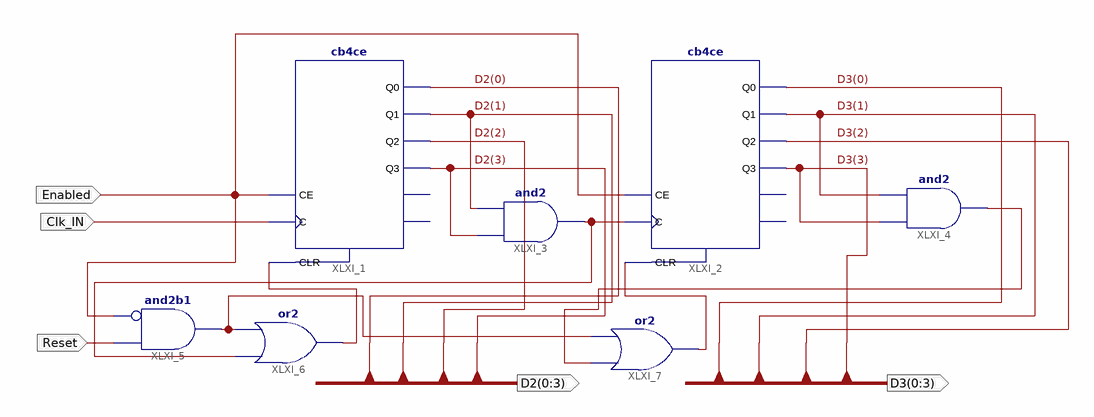
[diagram p0: schematic sheet 1]
// Xilinx ISE schematic Min.sch (spartan6) as structural Verilog: 7 symbols, 5 ports
module Min (
  input  Enabled,
  input  Clk_IN,
  input  Reset,
  output [0:3] D2,
  output [0:3] D3
);

  wire XLXN_38, XLXN_39, XLXN_40, XLXN_41, XLXN_42;

  cb4ce XLXI_1 (
    .C(Clk_IN), .CE(Enabled), .CLR(XLXN_40), .Q0(D2[0]), .Q1(D2[1]), .Q2(D2[2]), .Q3(D2[3]));  // open: CEO, TC
  cb4ce XLXI_2 (
    .C(XLXN_39), .CE(Enabled), .CLR(XLXN_41), .Q0(D3[0]), .Q1(D3[1]), .Q2(D3[2]), .Q3(D3[3]));  // open: CEO, TC
  and XLXI_3 (XLXN_39, D2[3], D2[1]);
  and XLXI_4 (XLXN_42, D3[3], D3[1]);
  and XLXI_5 (XLXN_38, ~Enabled, Reset);  // and2b1
  or XLXI_6 (XLXN_40, XLXN_39, XLXN_38);
  or XLXI_7 (XLXN_41, XLXN_42, XLXN_38);
endmodule
